# EAGLE board EEZ PSU power board r5B6c (EAGLE 6.1), part 1 of 2
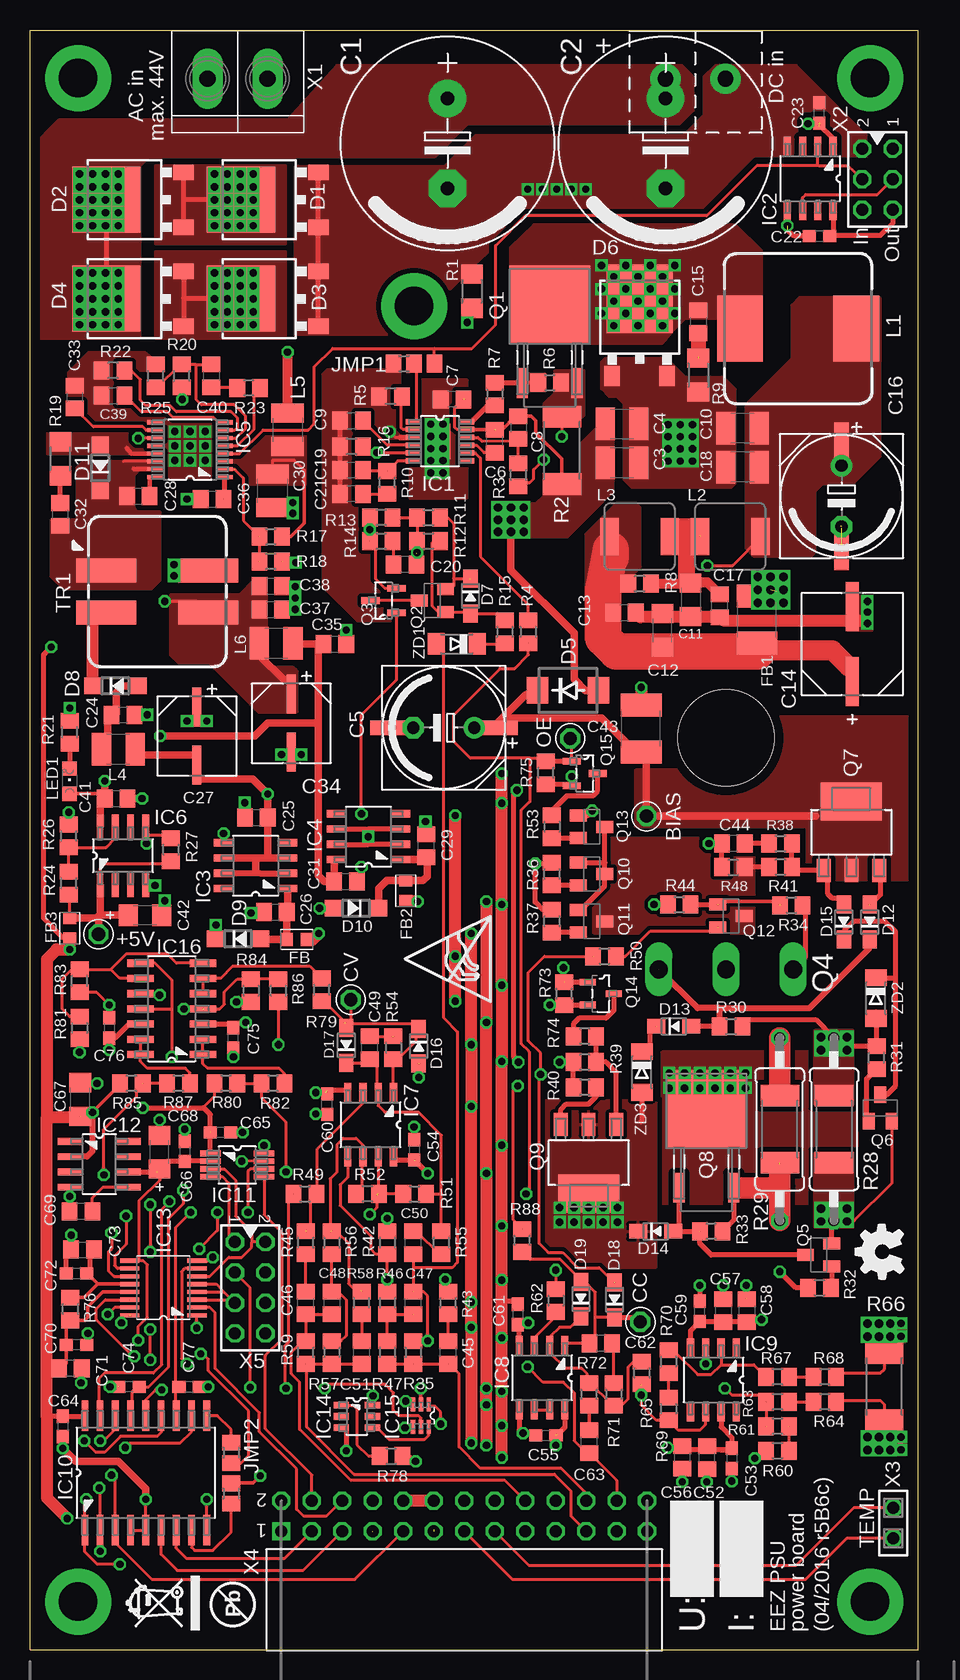
[diagram p5: board, top side]
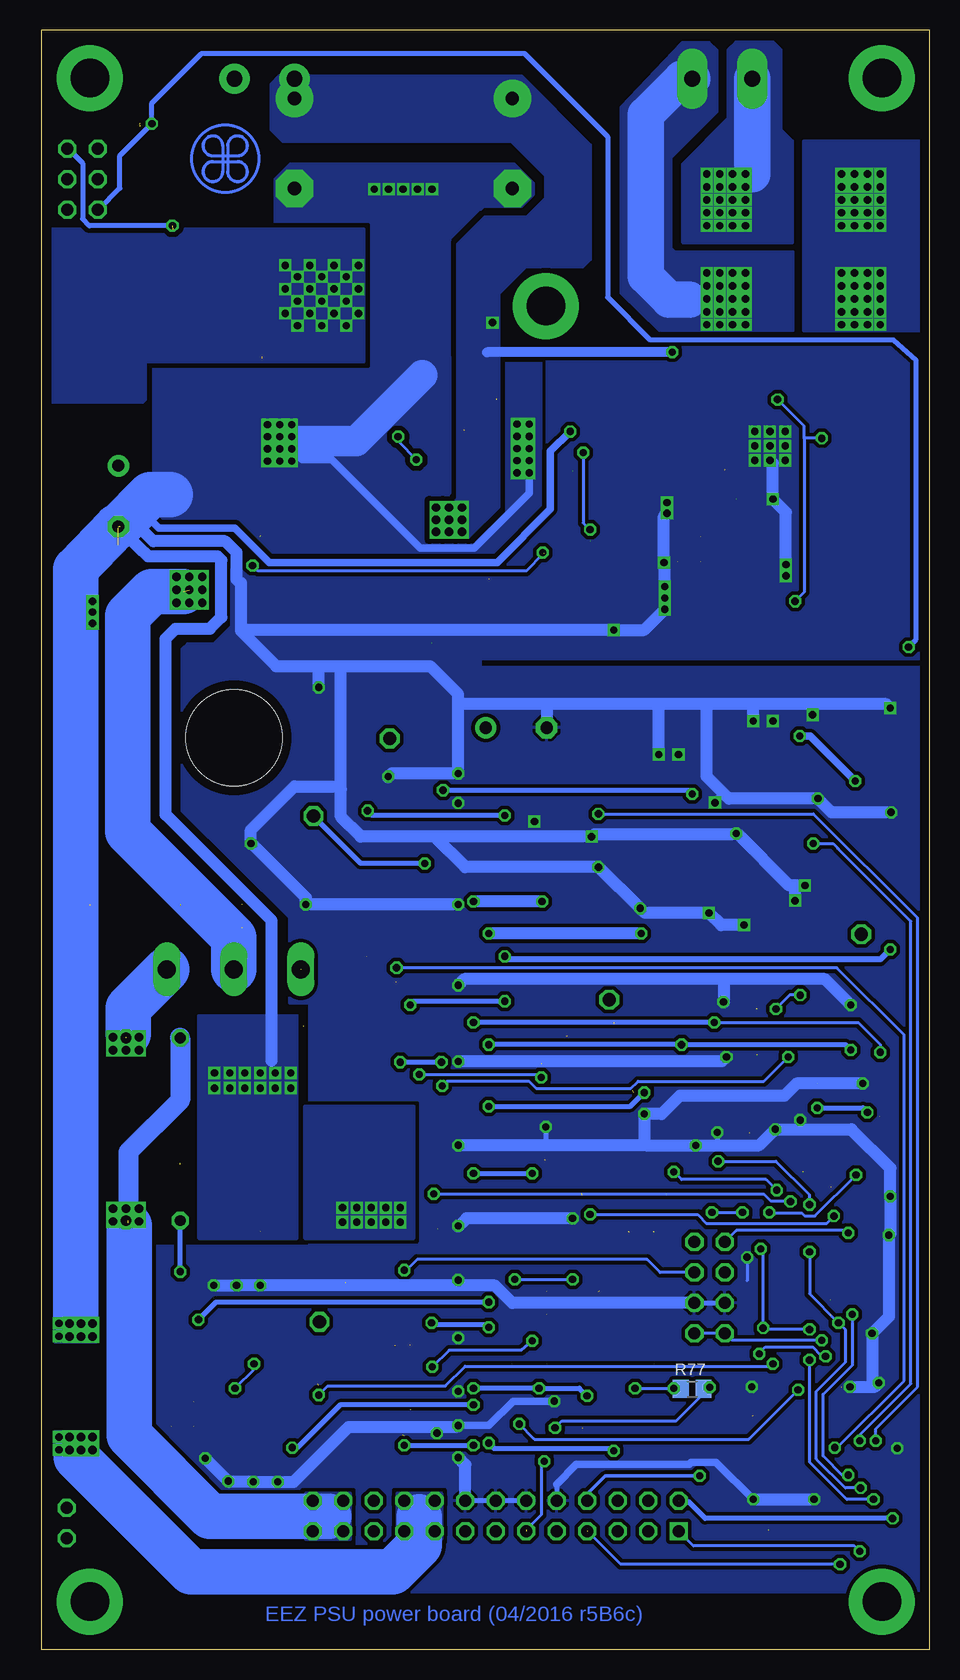
[diagram p6: board, bottom side, seen from below]

Size 74 x 135 mm. Coordinates in mm from the lower left corner, seen from the top.
Outline: 74,0 74,135 0,135 0,0 74,0
Copper layers (1+5*16): Top 0.035mm / dielectric 0.75mm / Route5 0.035mm / dielectric 0.75mm / Bottom 0.035mm
Design rules: minimum track width 10mil, minimum drill 0.5mm, track to track 8mil, track to pad 8mil, pad to pad 8mil, via to via 8mil, smd to smd 8mil, copper to edge 30mil, drill to drill 8mil, minimum pad ring 10mil, minimum via ring 8mil, stop-mask expansion 4mil, vias tented up to drill 25mil, thermal gap 10mil
Net classes: 0 default: width 0.254 mm, drill 0.584 mm, clearance 0.254 mm; 1 dgnd: width 0.254 mm, drill 0.584 mm, clearance 0.254 mm; 2 gnd: width 0.254 mm, drill 0.584 mm, clearance 0.254 mm

## Footprints (pad centres in the part's own frame; a part is rotated, then mirrored left to right if it is on the bottom)
PCB_SHIELD_TAB = drill 1.1 octagon: 1 0,0
ECAP7.5/18 = drill 1.1 pad 3.14: + -3.75,0 | drill 1.1 pad 3.14 octagon: - 3.75,0
C1210 = smd 1.6 x 2.7: 1 -1.4,0; 2 1.4,0
ECAP5/10.5+PANASONIC_F = drill 1.016 pad 1.778: + -2.54,0 | smd 4.166 x 1.194: +.1 -4.064,0; -.1 4.064,0 | drill 1.016 pad 1.778 octagon: - 2.54,0
C0805 = smd 1.3 x 1.5: 1 -0.95,0; 2 0.95,0
C1206 = smd 1.6 x 1.8: 1 -1.4,0; 2 1.4,0
CAPAE830X1050N = smd 4.064 x 1.092: 1 -3.124,0; 2 3.124,0
C0603 = smd 1.1 x 1: 1 -0.85,0; 2 0.85,0
CAPAE660X610N = smd 3.251 x 0.762: 1 -2.413,0; 2 2.413,0
EC1206 = smd 1.6 x 1.8: + -1.4,0; - 1.4,0
C1812 = smd 1.9 x 3.4: 1 -1.95,0; 2 1.95,0
TO252@1 = smd 1.3 x 1.7: 1 -2.285,-5.49; 2 2.285,-5.49 | smd 5.5 x 5.7: 3 0,0.95
DO214AA = smd 1.8 x 2.2: A 2.55,0; C -2.55,0
SOD323-W = smd 1.5 x 1.2: A 1.45,0; C -1.45,0
SOD123 = smd 1.4 x 1.4: A 1.9,0; C -1.9,0
BEAD0603 = smd 1 x 1.1: P$1 -0.85,0; P$2 0.85,0
L1812 = smd 1.9 x 3.4: 1 -1.95,0; 2 1.95,0
LTC_05-08-1666 = smd 1.27 x 0.457: 1 -2.235,1.63; 2 -2.235,0.98; 3 -2.235,0.33; 4 -2.235,-0.33; 5 -2.235,-0.98; 6 -2.235,-1.63; 7 2.235,-1.63; 8 2.235,-0.98; 9 2.235,-0.33; 10 2.235,0.33; 11 2.235,0.98; 12 2.235,1.63 | smd 1.753 x 2.946: TP 0,0
SOIC127P600X173-8N = smd 1.55 x 0.6: 1 -2.7,1.9; 2 -2.7,0.63; 3 -2.7,-0.64; 4 -2.7,-1.91; 5 2.7,-1.91; 6 2.7,-0.64; 7 2.7,0.63; 8 2.7,1.9
SOP65P640X110-16N = smd 1.422 x 0.356: 1 -2.845,2.286; 2 -2.845,1.626; 3 -2.845,0.965; 4 -2.845,0.33; 5 -2.845,-0.33; 6 -2.845,-0.965; 7 -2.845,-1.626; 8 -2.845,-2.286; 9 2.845,-2.286; 10 2.845,-1.626; 11 2.845,-0.965; 12 2.845,-0.33; 13 2.845,0.33; 14 2.845,0.965; 15 2.845,1.626; 16 2.845,2.286
SOIC127P600X175-8N = smd 1.981 x 0.559: 1 -2.464,1.905; 2 -2.464,0.635; 3 -2.464,-0.635; 4 -2.464,-1.905; 5 2.464,-1.905; 6 2.464,-0.635; 7 2.464,0.635; 8 2.464,1.905
SOIC127P1030X265-18N = smd 2.54 x 0.559: 1 -4.775,5.08; 2 -4.775,3.81; 3 -4.775,2.54; 4 -4.775,1.27; 5 -4.775,0; 6 -4.775,-1.27; 7 -4.775,-2.54; 8 -4.775,-3.81; 9 -4.775,-5.08; 10 4.775,-5.08; 11 4.775,-3.81; 12 4.775,-2.54; 13 4.775,-1.27; 14 4.775,0; 15 4.775,1.27; 16 4.775,2.54; 17 4.775,3.81; 18 4.775,5.08
DGK8-M = smd 1.727 x 0.483: 1 -2.235,0.965; 2 -2.235,0.33; 3 -2.235,-0.33; 4 -2.235,-0.965; 5 2.235,-0.965; 6 2.235,-0.33; 7 2.235,0.33; 8 2.235,0.965
PW(R-PDSO-G16) = smd 1.6 x 0.35: 1 -2.8,2.3; 2 -2.8,1.65; 3 -2.8,1; 4 -2.8,0.35; 5 -2.8,-0.3; 6 -2.8,-0.95; 7 -2.8,-1.6; 8 -2.8,-2.25; 9 2.8,-2.25; 10 2.8,-1.6; 11 2.8,-0.95; 12 2.8,-0.3; 13 2.8,0.35; 14 2.8,1; 15 2.8,1.65; 16 2.8,2.3
SOT95P280X145-6N = smd 1.27 x 0.559: 1 -1.295,0.94; 2 -1.295,0; 3 -1.295,-0.94; 4 1.295,-0.94; 5 1.295,0; 6 1.295,0.94
SOT65P210X110-6N = smd 1.168 x 0.356: 1 -0.94,0.66; 2 -0.94,0; 3 -0.94,-0.66; 4 0.94,-0.66; 5 0.94,0; 6 0.94,0.66
SOIC127P600X175-14N = smd 2.2 x 0.6: 1 -2.591,3.81; 2 -2.591,2.54; 3 -2.591,1.27; 4 -2.591,0; 5 -2.591,-1.27; 6 -2.591,-2.54; 7 -2.591,-3.81; 8 2.591,-3.81; 9 2.591,-2.54; 10 2.591,-1.27; 11 2.591,0; 12 2.591,1.27; 13 2.591,2.54; 14 2.591,3.81
A0R-JMP = smd 1.5 x 1.3: 1 0,1.7; 2 0,0; 3 0,-1.7
0R-JMP4 = smd 1.5 x 1.3: 1 0,1.7; 2 0,0; 3 0,-1.7; 4 0,-3.4
MSS1210 = smd 5.5 x 3.8: 1 0,4.85; 2 0,-4.85
IHLP-2020BZ-11 = smd 3.048 x 1.524: 1 0,2.515; 2 0,-2.515
L1210 = smd 1.6 x 2.7: 1 -1.4,0; 2 1.4,0
CHIPLED_0805 = smd 1.2 x 1.2: A 0,-1.05; C 0,1.05
TO229P990X239-3N = smd 0.94 x 2.489: 1 -2.286,-6.401; 3 2.286,-6.401 | smd 6.731 x 6.528: 2 0,0.152
SOT23-BEC = smd 1 x 1.4: B -0.95,-1.1; C 0,1.1; E 0.95,-1.1
SOT103P240X110-3N = smd 1.524 x 0.559: 1 -1.079,1.016; 2 -1.079,-1.016; 3 1.079,0
TO247BH-CLR = drill 1.499 long: D 0,-19.304; G -5.588,-19.304; S 5.588,-19.304 | hole 8: 0,0
SOT230P700X180-4N = smd 1.905 x 1.143: 1 -3.2,2.311; 2 -3.2,0; 3 -3.2,-2.311 | smd 3.175 x 5.08: 4 2.565,0
SOT95P237X112-3N = smd 1.321 x 0.559: 1 -1.092,0.94; 2 -1.092,-0.94; 3 1.092,0
R1206 = smd 1.6 x 1.803: 1 -1.422,0; 2 1.422,0
R2512 = smd 1.8 x 3.2: 1 -2.8,0; 2 2.8,0
R0805 = smd 1.3 x 1.5: 1 -0.95,0; 2 0.95,0
R_2512+0411/15 = drill 0.914 octagon: 1 -7.62,0; 2 7.62,0 | smd 1.8 x 3.2: 1.1 -2.8,0; 2.1 2.8,0
SHORT_NOHOLE = smd 0.5 x 0.25 bottom: P$1 0,0.117; P$2 0,-0.117
MSD1260 = smd 2 x 5: 1 1.75,4.25; 2 -1.75,4.25; 3 -1.75,-4.25; 4 1.75,-4.25
TBLOCK5.0_2 = drill 1.35 pad 2.54 long: 1 0,0; 2 0,-5
TSW-103-07-F-D = drill 1 pad 1.5 octagon: 1 5.08,0; 2 5.08,2.54; 3 2.54,0; 4 2.54,2.54; 5 0,0; 6 0,2.54
SSW-102-02-S-S = drill 1 pad 1.5 octagon: 1 -1.27,0; 2 1.27,0
SSW-113-02-T-D-RA = drill 1 pad 1.5 square: 1 30.48,2.54 | drill 1 pad 1.5 octagon: 2 30.48,0; 3 27.94,2.54; 4 27.94,0; 5 25.4,2.54; 6 25.4,0; 7 22.86,2.54; 8 22.86,0; 9 20.32,2.54; 10 20.32,0; 11 17.78,2.54; 12 17.78,0; 13 15.24,2.54; 14 15.24,0; 15 12.7,2.54; 16 12.7,0; 17 10.16,2.54; 18 10.16,0; 19 7.62,2.54; 20 7.62,0; 21 5.08,2.54; 22 5.08,0; 23 2.54,2.54; 24 2.54,0; 25 0,2.54; 26 0,0
TSW-104-02-S-D = drill 1 pad 1.5 octagon: 1 -3.81,-1.27; 2 -3.81,1.27; 3 -1.27,-1.27; 4 -1.27,1.27; 5 1.27,-1.27; 6 1.27,1.27; 7 3.81,-1.27; 8 3.81,1.27
MINIMELF = smd 1.4 x 1.8: A 1.7,0; C -1.7,0

## Placement (x,y rotation side)
+5V  735427-2  [PCB_SHIELD_TAB]  5.71,59.63 0 top
BIAS  735427-2  [PCB_SHIELD_TAB]  51.37,69.47 0 top
C1  2m2  [ECAP7.5/18]  34.8,125.54 270 top
C2  2m2  [ECAP7.5/18]  52.96,125.54 270 top
C3  4u7  [C1210]  49.34,98.93 0 top
C4  4u7  [C1210]  49.34,102.17 0 top
C5  EEEFK1J101P  [ECAP5/10.5+PANASONIC_F]  34.48,76.83 180 top
C6  470n  [C0805]  38.73,100.71 90 top
C7  100n  [C0805]  35.18,104.2 180 top
C8  100p  [C0805]  40.7,101.85 270 top
C9  100n  [C0805]  26.8,102.43 0 top
C10  10u  [C1210]  59.37,101.79 180 top
C11  1u  [C1206]  55.05,87.5 270 top
C12  1u  [C1206]  52.7,84.96 90 top
C13  100n  [C0805]  49.53,86.42 0 top
C14  EEEFK1J470P  [CAPAE830X1050N]  68.52,83.82 90 top
C15  330p  [C0805]  55.69,110.68 270 top
C16  EEEFK1J101P  [ECAP5/10.5+PANASONIC_F]  67.63,96.14 270 top
C17  100n  [C0805]  57.47,87 90 top
C18  10u  [C1210]  59.37,98.55 180 top
C19  22p  [C0805]  26.8,98.3 180 top
C20  47n  [C0805]  31.24,90.42 180 top
C21  1n5  [C0805]  26.8,96.33 180 top
C22  100n  [C0603]  65.79,117.79 180 top
C23  100n  [C0603]  65.79,128.08 90 top
C24  2u2  [C0805]  7.75,77.91 0 top
C25  330n  [C0805]  18.86,69.34 0 top
C26  100n  [C0805]  20.45,61.47 0 top
C27  47u  [CAPAE660X610N]  13.91,76.14 270 top
C28  22n  [C0805]  9.02,96.14 0 top
C29  100n  [C0805]  33.02,66.99 90 top
C30  2u2/100V  [C1210]  20.19,96.58 270 top
C31  330n  [C0805]  26.29,64.01 0 top
C32  330p  [C0805]  2.54,94.61 90 top
C33  10n  [C0805]  3.75,104.39 90 top
C34  47u  [CAPAE660X610N]  21.78,77.22 270 top
C35  2u2  [C0805]  25.4,83.82 0 top
C36  100n  [C0805]  15.18,95.89 0 top
C37  2u2  [C0805]  20.07,86.68 0 top
C38  2u2  [C0805]  20.07,88.65 0 top
C39  3n3  [C0805]  6.92,104.52 0 top
C40  1n  [C0805]  15.11,106.17 270 top
C41  100n  [C0805]  7.18,70.93 0 top
C42  4u7  [EC1206]  9.59,61.21 0 top
C43  470n  [C1812]  50.93,76.77 90 top
C44  10n  [C0805]  58.61,67.18 180 top
C45  47p  [C0805]  34.86,24.77 90 top
C46  1n5  [C0805]  22.99,28.89 90 top
C47  2n2  [C0805]  31.94,28.89 90 top
C48  2n2  [C0805]  25.15,28.89 270 top
C49  120p  [C0805]  28.32,50.16 90 top
C50  1n5  [C0805]  31.94,33.91 90 top
C51  47p  [C0805]  27.64,24.77 90 top
C52  10n  [C0805]  56.42,16 90 top
C53  100n  [C0603]  58.48,15.94 270 top
C54  100n  [C0603]  32,41.66 270 top
C55  100n  [C0603]  42.99,17.84 0 top
C56  1u  [C0805]  54.37,16.02 90 top
C57  10n  [C0805]  57.78,28.26 270 top
C58  1u  [C0805]  59.74,28.26 270 top
C59  100n  [C0603]  55.82,28.19 90 top
C60  100n  [C0603]  24.77,45.47 90 top
C61  100n  [C0603]  40.64,27.94 270 top
C62  1n  [C0805]  47.56,25.53 180 top
C63  1n  [C0805]  46.61,17.34 90 top
C64  100n  [C0603]  2.73,18.61 270 top
C65  100n  [C0603]  15.88,43.12 180 top
C66  100n  [C0603]  12.89,41.53 270 top
C67  10u  [C1206]  4.19,45.85 90 top
C68  10u  [EC1206]  10.79,41.47 90 top
C69  1u  [C0805]  4.25,36.51 180 top
C70  100n  [C0603]  3.87,25.4 180 top
C71  1u  [C0805]  3.37,23.43 180 top
C72  100n  [C0603]  3.87,31.37 0 top
C73  1u  [C0805]  4.38,33.34 0 top
C74  0  [C0603]  8.26,21.91 180 top
C75  100n  [C0603]  16.95,50.99 90 top
C76  100n  [C0603]  6.6,51.82 270 top
C77  0  [C0603]  13.27,21.91 0 top
CC  735427-2  [PCB_SHIELD_TAB]  50.86,27.3 0 top
CV  735427-2  [PCB_SHIELD_TAB]  26.73,54.17 0 top
D1  STPS15H100  [TO252@1]  18.54,120.84 90 top
D2  STPS15H100  [TO252@1]  7.3,120.84 90 top
D3  STPS15H100  [TO252@1]  18.54,112.59 90 top
D4  STPS15H100  [TO252@1]  7.3,112.59 90 top
D5  SS110  [DO214AA]  44.83,79.95 0 top
D6  VS-50WQ10F  [TO252@1]  50.8,111.63 0 top
D7  1N4148WS  [SOD323-W]  36.7,87.82 270 top
D8  DFLS1100-7  [SOD123]  7.11,80.33 0 top
D9  SKL16  [SOD123]  17.34,59.25 0 top
D10  SKL16  [SOD123]  27.18,61.79 180 top
D11  DFLS1100-7  [SOD123]  5.84,98.49 90 top
D12  BAS316  [SOD323-W]  69.98,60.64 90 top
D13  BAS316  [SOD323-W]  53.66,51.94 0 top
D14  BAS316  [SOD323-W]  52.13,34.86 0 top
D15  BAS316  [SOD323-W]  67.82,60.64 90 top
D16  BAS316  [SOD323-W]  32.38,50.29 270 top
D17  BAS316  [SOD323-W]  26.35,50.36 90 top
D18  BAS316  [SOD323-W]  48.7,29.15 90 top
D19  BAS316  [SOD323-W]  45.91,29.21 90 top
EEZ_SIGNATURE  SIGNATURESMALL  [SIGNATURE_5MM]  58.73,124.27 270 top
FB  60R@100MHz  [BEAD0603]  22.23,59.18 0 top
FB1  2743019447  [L1812]  60.58,85.85 90 top
FB2  60R@100MHz  [BEAD0603]  31.31,63.25 270 top
FB3  60R@100MHz  [BEAD0603]  3.3,60.13 270 top
IC1  LTC3864  [LTC_05-08-1666]  34.16,100.71 0 top
IC2  Si8610BC-B-IS  [SOIC127P600X173-8N]  65.02,122.62 270 top
IC3  MC79L05  [SOIC127P600X173-8N]  18.8,65.34 180 top
IC4  MC78L05  [SOIC127P600X173-8N]  28.19,67.75 180 top
IC5  LM5574  [SOP65P640X110-16N]  13.34,100.01 180 top
IC6  LP2951SO8  [SOIC127P600X175-8N]  7.75,66.17 90 top
IC7  TL072D  [SOIC127P600X173-8N]  28.38,43.75 270 top
IC8  TL072D  [SOIC127P600X173-8N]  42.67,22.67 270 top
IC9  OP27GSZ  [SOIC127P600X173-8N]  56.96,22.48 270 top
IC10  MCP23S08-E/SO  [SOIC127P1030X265-18N]  9.65,14.73 90 top
IC11  DAC8552  [DGK8-M]  17.27,40.39 0 top
IC12  REF5025  [SOIC127P600X175-8N]  5.78,40.45 0 top
IC13  ADS1120  [PW(R-PDSO-G16)]  11.11,30.16 180 top
IC14  ADG465SOT-23  [SOT95P280X145-6N]  27.24,19.43 0 top
IC15  TS5A9411DCKT  [SOT65P210X110-6N]  32.58,19.49 270 top
IC16  LP339D  [SOIC127P600X175-14N]  11.81,53.4 180 top
JMP1  0R-JUMPA  [A0R-JMP]  32,107.19 90 top
JMP2  0R-JMP41-2,3-4  [0R-JMP4]  16.76,15.56 0 top
L1  MSS1210-333  [MSS1210]  64.01,110.11 90 top
L2  IHLP2020CZER3R3M11  [IHLP-2020BZ-11]  58.36,92.77 270 top
L3  IHLP2020CZER3R3M11  [IHLP-2020BZ-11]  50.8,92.77 270 top
L4  2u2  [L1210]  7.37,75.06 0 top
L5  2u2  [L1210]  21.46,101.66 270 top
L6  2u2  [L1210]  20.51,83.88 0 top
LED1  HSMY-C170  [CHIPLED_0805]  3.3,72.39 0 top
OE  735427-2  [PCB_SHIELD_TAB]  45.02,75.95 0 top
Q1  SUD19P06-60  [TO229P990X239-3N]  43.31,111.95 0 top
Q2  MMBT5401  [SOT23-BEC]  33.53,87.44 90 top
Q3  2N7002  [SOT103P240X110-3N]  29.46,87.44 180 top
Q4  IRFP250N  [TO247BH-CLR]  58,76 0 top
Q5  BC857C  [SOT23-BEC]  65.72,32.89 90 top
Q6  BC846C  [SOT23-BEC]  70.87,45.15 0 top
Q7  BCP56-16.115  [SOT230P700X180-4N]  68.45,68.14 90 top
Q8  IRFR5410  [TO229P990X239-3N]  56.37,44.9 0 top
Q9  BCP56-16.115  [SOT230P700X180-4N]  46.55,40.58 270 top
Q10  MMBT5401  [SOT23-BEC]  46.8,64.64 270 top
Q11  MMBT5401  [SOT23-BEC]  46.8,60.71 270 top
Q12  MMBT5551  [SOT23-BEC]  58.42,61.15 270 top
Q13  MMBT5551  [SOT23-BEC]  46.8,68.58 270 top
Q14  BSS84P  [SOT95P237X112-3N]  47.56,54.67 0 top
Q15  2N7002  [SOT103P240X110-3N]  46.23,73.03 0 top
R1  18K  [R1206]  36.83,113.22 90 top
R2  R020/2W  [R2512]  44.32,99.95 90 top
R3  0R  [R0805]  40.7,97.92 90 top
R4  0R  [R0805]  41.53,84.84 270 top
R5  0R  [R0805]  30.04,104.46 180 top
R6  100K  [R0805]  43.31,105.6 0 top
R7  0R  [R0805]  38.73,104.65 270 top
R8  100R  [R0805]  50.8,88.84 180 top
R9  10R  [R1206]  55.69,106.24 90 top
R10  51K  [R0805]  29.78,97.28 90 top
R11  390R  [R0805]  33.21,94.36 0 top
R12  100K  [R0805]  33.21,92.39 0 top
R13  240K  [R0805]  29.27,94.36 180 top
R14  0R  [R0805]  29.27,92.39 0 top
R15  11K  [R0805]  39.56,84.84 270 top
R16  4K32  [R0805]  26.8,100.27 180 top
R17  39K  [R0805]  20.07,92.77 0 top
R18  1K8  [R0805]  20.07,90.68 180 top
R19  10R  [R1206]  2.54,99.25 270 top
R20  30K  [R0805]  12.64,106.17 90 top
R21  390R  [R0805]  3.3,76.45 90 top
R22  22K  [R0805]  6.92,106.62 180 top
R23  51K  [R0805]  18.22,105.16 180 top
R24  12K  [R0805]  3.24,63.88 90 top
R25  4K7  [R0805]  10.48,106.17 90 top
R26  3K9  [R0805]  3.24,67.82 90 top
R27  10K  [R0805]  11.75,66.67 90 top
R28  0R1/3W  [R_2512+0411/15]  66.99,43.37 270 top
R29  2R2/2W  [R_2512+0411/15]  62.48,43.37 90 top
R30  2K2  [R0805]  58.42,51.94 0 top
R31  1K  [R0805]  70.55,49.34 90 top
R32  2K2  [R0805]  65.79,30.16 0 top
R33  2K2  [R0805]  56.77,34.86 180 top
R34  16K  [R0805]  63.44,62.04 0 top
R35  2K  [R0805]  31.94,24.77 270 top
R36  220R  [R0805]  43.5,64.64 90 top
R37  220R  [R0805]  43.5,60.71 90 top
R38  470R  [R0805]  62.55,67.18 0 top
R39  1K  [R0805]  46.23,48.96 180 top
R40  220R  [R0805]  46.23,46.86 180 top
R41  100R  [R0805]  62.55,65.21 180 top
R42  7K5  [R0805]  29.78,33.91 270 top
R43  10K  [R0805]  34.86,28.89 90 top
R44  560R  [R0805]  54.1,62.1 0 top
R45  220R  [R0805]  22.99,33.91 90 top
R46  100K  [R0805]  29.78,28.89 270 top
R47  20K  [R0805]  29.78,24.77 270 top
R48  51K  [R0805]  58.61,65.21 0 top
R49  10K  [R0805]  22.92,37.97 0 top
R50  470R  [R0805]  47.88,57.78 0 top
R51  10K  [R0805]  32.05,37.97 0 top
R52  7K5  [R0805]  28.13,37.97 180 top
R53  1K8  [R0805]  43.5,68.58 270 top
R54  0R  [R0805]  30.29,50.16 270 top
R55  220R  [R0805]  34.29,33.91 90 top
R56  100K  [R0805]  25.15,33.91 270 top
R57  20K  [R0805]  25.15,24.77 270 top
R58  10K  [R0805]  27.64,28.89 90 top
R59  2K  [R0805]  22.99,24.77 90 top
R60  180R 0.1%  [R0805]  62.29,16.57 0 top
R61  3K9 0.1%  [R0805]  62.29,18.61 180 top
R62  2K2  [R0805]  43.83,29.09 270 top
R63  51R 0.1%  [R0805]  62.29,20.64 180 top
R64  51R 0.1%  [R0805]  66.23,20.64 180 top
R65  2K2  [R0805]  50.99,23.06 90 top
R66  R020/2W  [R2512]  71.18,21.91 90 top
R67  51R 0.1%  [R0805]  62.29,22.73 180 top
R68  51R 0.1%  [R0805]  66.23,22.73 180 top
R69  3K9 0.1%  [R0805]  53.21,20.07 270 top
R70  180R 0.1%  [R0805]  53.21,24 270 top
R71  11K  [R0805]  48.64,21.27 270 top
R72  10K  [R0805]  46.61,21.27 90 top
R73  100K  [R0805]  44.51,54.67 90 top
R74  10K  [R0805]  46.23,51.12 180 top
R75  100K  [R0805]  42.99,73.09 90 top
R76  10R  [R0805]  3.37,28.38 90 top
R77  0R  [R0805]  19.81,21.72 0 bottom
R78  1K  [R0805]  30.1,16.13 0 top
R79  10K  [R0805]  24.32,54.99 90 top
R80  5K1  [R0805]  16.32,47.18 180 top
R81  47K  [R0805]  4.13,51.82 270 top
R82  5K6  [R0805]  20.26,47.18 180 top
R83  2K2  [R0805]  4.13,55.75 90 top
R84  10K  [R0805]  18.41,54.93 270 top
R85  5K1  [R0805]  8.45,47.18 180 top
R86  12K  [R0805]  20.7,54.93 90 top
R87  5K6  [R0805]  12.38,47.18 180 top
R88  10K  [R0805]  41.02,34.1 90 top
SH1  Pgnd to Pout- short  [SHORT_NOHOLE]  67.63,93.6 270 top
SH2  Sgnd to Pgnd short  [SHORT_NOHOLE]  67.63,93.6 0 top
TR1  MSD1260-824  [MSD1260]  10.6,88.2 90 top
U$2  [RECYCLE_BIN1/8]  14.16,1.59 90 top
U$3  [PB_SMALL]  16.89,3.75 90 top
U$4  [ESD_SYMBOL]  38.38,54.01 90 top
X1  282836-2  [TBLOCK5.0_2]  14.8,130.94 90 top
X2  826925-3  [TSW-103-07-F-D]  71.88,120.02 90 top
X3  SSW-102-02-S-S  [SSW-102-02-S-S]  71.95,10.54 90 top
X4  SSW-113-02-T-D-RA  [SSW-113-02-T-D-RA]  51.42,12.4 180 top
X5  TSW-104-08-L-D  [TSW-104-02-S-D]  18.35,30.16 270 top
ZD1  3V3  [MINIMELF]  35.56,83.82 180 top
ZD2  13V  [MINIMELF]  70.48,54.29 270 top
ZD3  6V2  [MINIMELF]  50.99,48.13 270 top